# Altium schematic sheet TFT_TOUCH.SchDoc
size A4; Organization: Altium Limited; Address1: 3 Minna Close; Address2: Belrose; Address3: NSW 2086; Address4: Australia
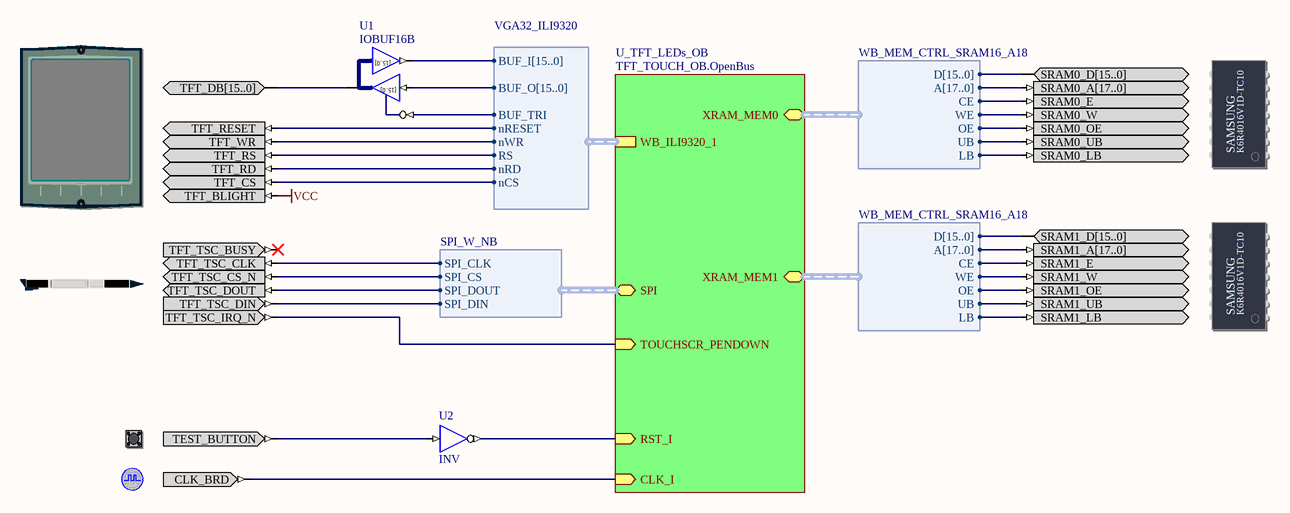
[diagram p0: TFT_TOUCH.SchDoc]

## Parts
(Parts that share a designator on the sheet are numbered #1, #2 ... from top to bottom, then left to right.)
?#1  SRAM0  (value not drawn)
?#2  TFT_LCD  (value not drawn)
?#3  SRAM1  (value not drawn)
?#4  TOUCH_SCREEN_PEN  (value not drawn)
?#5  TEST_BUTTON  (value not drawn)
?#6  CLOCK_BOARD  (value not drawn)
U1  IOBUF16B
U2  INV

## Sub-sheets
U_TFT_LEDs_OB = TFT_TOUCH_OB.OpenBus: WB_ILI9320_1 (harness VGA32_ILI9320), TOUCHSCR_PENDOWN (in), RST_I (in), CLK_I (in), SPI (harness SPI_W_NB), XRAM_MEM0 (harness WB_MEM_CTRL_SRAM16_A18), XRAM_MEM1 (harness WB_MEM_CTRL_SRAM16_A18)

## Harnesses
VGA32_ILI9320: BUF_I[15..0], BUF_O[15..0], BUF_TRI, nRESET, nWR, RS, nRD, nCS
SPI_W_NB: SPI_DOUT, SPI_DIN, SPI_CLK, SPI_CS
WB_MEM_CTRL_SRAM16_A18: D[15..0], A[17..0], CE, WE, OE, UB, LB

## Nets
VCC: ?#2.TFT_BLIGHT
Net?#1_SRAM0_A[17..0]: ?#1.SRAM0_A[17..0] ; sheet U_TFT_LEDs_OB/XRAM_MEM0.A[17..0]
Net?#1_SRAM0_D[15..0]: ?#1.SRAM0_D[15..0] ; sheet U_TFT_LEDs_OB/XRAM_MEM0.D[15..0]
Net?#1_SRAM0_E: ?#1.SRAM0_E ; sheet U_TFT_LEDs_OB/XRAM_MEM0.CE
Net?#1_SRAM0_LB: ?#1.SRAM0_LB ; sheet U_TFT_LEDs_OB/XRAM_MEM0.LB
Net?#1_SRAM0_OE: ?#1.SRAM0_OE ; sheet U_TFT_LEDs_OB/XRAM_MEM0.OE
Net?#1_SRAM0_UB: ?#1.SRAM0_UB ; sheet U_TFT_LEDs_OB/XRAM_MEM0.UB
Net?#1_SRAM0_W: ?#1.SRAM0_W ; sheet U_TFT_LEDs_OB/XRAM_MEM0.WE
Net?#2_TFT_CS: ?#2.TFT_CS ; sheet U_TFT_LEDs_OB/WB_ILI9320_1.nCS
Net?#2_TFT_DB[15..0]: ?#2.TFT_DB[15..0] U1.IO[15..0]
Net?#2_TFT_RD: ?#2.TFT_RD ; sheet U_TFT_LEDs_OB/WB_ILI9320_1.nRD
Net?#2_TFT_RESET: ?#2.TFT_RESET ; sheet U_TFT_LEDs_OB/WB_ILI9320_1.nRESET
Net?#2_TFT_RS: ?#2.TFT_RS ; sheet U_TFT_LEDs_OB/WB_ILI9320_1.RS
Net?#2_TFT_WR: ?#2.TFT_WR ; sheet U_TFT_LEDs_OB/WB_ILI9320_1.nWR
Net?#3_SRAM1_A[17..0]: ?#3.SRAM1_A[17..0] ; sheet U_TFT_LEDs_OB/XRAM_MEM1.A[17..0]
Net?#3_SRAM1_D[15..0]: ?#3.SRAM1_D[15..0] ; sheet U_TFT_LEDs_OB/XRAM_MEM1.D[15..0]
Net?#3_SRAM1_E: ?#3.SRAM1_E ; sheet U_TFT_LEDs_OB/XRAM_MEM1.CE
Net?#3_SRAM1_LB: ?#3.SRAM1_LB ; sheet U_TFT_LEDs_OB/XRAM_MEM1.LB
Net?#3_SRAM1_OE: ?#3.SRAM1_OE ; sheet U_TFT_LEDs_OB/XRAM_MEM1.OE
Net?#3_SRAM1_UB: ?#3.SRAM1_UB ; sheet U_TFT_LEDs_OB/XRAM_MEM1.UB
Net?#3_SRAM1_W: ?#3.SRAM1_W ; sheet U_TFT_LEDs_OB/XRAM_MEM1.WE
Net?#4_TFT_TSC_CLK: ?#4.TFT_TSC_CLK ; sheet U_TFT_LEDs_OB/SPI.SPI_CLK
Net?#4_TFT_TSC_CS_N: ?#4.TFT_TSC_CS_N ; sheet U_TFT_LEDs_OB/SPI.SPI_CS
Net?#4_TFT_TSC_DIN: ?#4.TFT_TSC_DIN ; sheet U_TFT_LEDs_OB/SPI.SPI_DIN
Net?#4_TFT_TSC_DOUT: ?#4.TFT_TSC_DOUT ; sheet U_TFT_LEDs_OB/SPI.SPI_DOUT
Net?#4_TFT_TSC_IRQ_N: ?#4.TFT_TSC_IRQ_N ; sheet U_TFT_LEDs_OB/TOUCHSCR_PENDOWN
Net?#5_TEST_BUTTON: ?#5.TEST_BUTTON U2.I
Net?#6_CLK_BRD: ?#6.CLK_BRD ; sheet U_TFT_LEDs_OB/CLK_I
NetU1_I[15..0]: U1.I[15..0] ; sheet U_TFT_LEDs_OB/WB_ILI9320_1.BUF_O[15..0]
NetU1_O[15..0]: U1.O[15..0] ; sheet U_TFT_LEDs_OB/WB_ILI9320_1.BUF_I[15..0]
NetU1_T: U1.T ; sheet U_TFT_LEDs_OB/WB_ILI9320_1.BUF_TRI
NetU2_O: U2.O ; sheet U_TFT_LEDs_OB/RST_I

Not connected (* = marked no-connect by the designer): ?#4 TFT_TSC_BUSY*

## Notes on the sheet
- (in symbol IOBUF16B) [15..0]
- (in symbol SRAM0) SAMSUNG; K6R4016V1D-TC10
- (in symbol SRAM1) SAMSUNG; K6R4016V1D-TC10

## Library data of the parts
?#1 = SRAM0: Free Static RAM - Daughterboard; PortComponent: True; Published: 14-May-2007; Publisher: Altium Limited; HelpURL: TR0149 Technical Reference for Altium's Xilinx Spartan-3 Daughter Board DB30.pdf#page=16
?#2 = TFT_LCD: TFT LCD Panel; PortComponent: True; Published: 22-Jan-2007; Publisher: Altium Limited; HelpURL: TR0143 Technical Reference Manual for Altium's Desktop NanoBoard NB2DSK01.pdf#page=50
?#3 = SRAM1: Free Static RAM - Daughterboard; PortComponent: True; Published: 14-May-2007; Publisher: Altium Limited; HelpURL: TR0149 Technical Reference for Altium's Xilinx Spartan-3 Daughter Board DB30.pdf#page=16
?#4 = TFT_PEN: Touch Screen Pen Control; PortComponent: True; Published: 22-Jan-2007; Publisher: Altium Limited; HelpURL: TR0143 Technical Reference Manual for Altium's Desktop NanoBoard NB2DSK01.pdf#page=50
?#5 = TEST_BUTTON: Test / Reset Button; PortComponent: True; Published: 19-Nov-2003; Publisher: Altium Limited; HelpURL: TR0143 Technical Reference Manual for Altium's Desktop NanoBoard NB2DSK01.pdf#page=53
?#6 = CLOCK_BOARD: Global System Clock Supply; PortComponent: True; Published: 19-Nov-2003; Publisher: Altium Limited; HelpURL: https://wiki.altium.com/display/ADOH/NanoBoard+3000+-+System+Clocks; UseInDSF: True
U1 = IOBUF16B: 16-Bit Input/Output Buffer, Bus Version; SubClass: IOBUF; Enable: Low; Control: Common Control T; PortSize: 16; ArchiveName: GENERIC; VHDLIB_SIM: GENERIC_LIB; Published: 29-Jan-2004; Publisher: Altium Limited; LastRevisionNo: 1.00.00; HelpURL: CR0118 FPGA Generic Library Guide.pdf#page=293; ComponentLink1URL: CR0125 FPGA Buffer Resource Usage.pdf#page=91; ComponentLink1Description: Core &Resource Usage; FunctionalClass: Buffer; PortStyle: Bus Version
U2 = INV: Inverter; FunctionalClass: Logic Primitive; ArchiveName: GENERIC; VHDLIB_SIM: GENERIC_LIB; Published: 29-Jan-2004; Publisher: Altium Limited; XilinxEquivalent: INV; LastRevisionNo: 1.00.00; HelpURL: CR0118 FPGA Generic Library Guide.pdf#page=291; ComponentLink1URL: CR0136 FPGA Logic Primitive Resource Usage.pdf#page=61; ComponentLink1Description: Core &Resource Usage; SubClass: INV